# EAGLE design CR2032 emulator (EAGLE 9.6.2)
Assembly variants: basic
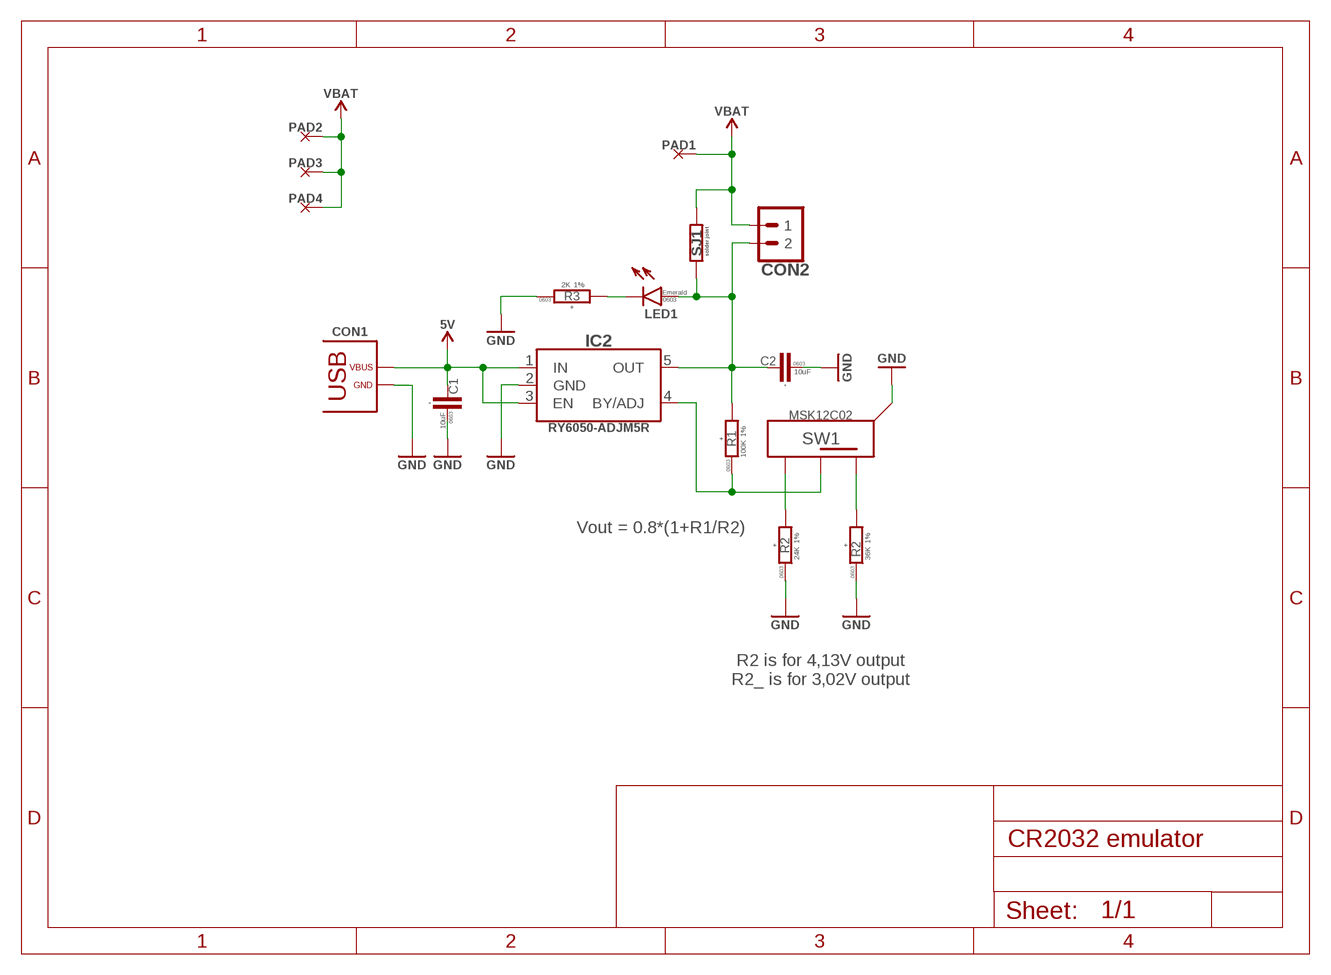
[diagram p0: schematic, sheet 1]

## Parts
C1  10uF  C-0603  [C0603]
C2  10uF  C-0603  [C0603]
CON1  USB_PWR-31-M-17  [TYPEC31M17]
CON2  PINHEAD_1X02-2  [1X02-PTH-2]  (not fitted in variant basic)
IC2  RY6050-ADJM5R  [SOT23-5]
LED1  LED-0603  [LED0603]
PAD1  PAD-3X1.5  [3X1.5]  (not fitted in variant basic)
PAD2  PAD-HOLE-0.6  [HOLE_0.6]  (not fitted in variant basic)
PAD3  PAD-HOLE-0.6  [HOLE_0.6]  (not fitted in variant basic)
PAD4  PAD-HOLE-0.6  [HOLE_0.6]  (not fitted in variant basic)
R1  100K  R-1%-0603  [R0603]
R2  24K  R-1%-0603  [R0603]
R2_  36K  R-1%-0603  [R0603]
R3  2K  R-1%-0603  [R0603]
SJ1  SOLDER_JOINT-SJ2  [SOLDER_JOINT_SMALL]  (not fitted in variant basic)
SW1  SPDT_SWITCH  [MSK-12C02]

## Nets
GND: C1.1 C2.1 CON1.A12(GND) CON1.B12(GND) IC2.2(GND) R2.1 R2_.1 R3.1 SW1.GND@1(PADS) SW1.GND@2(PADS) SW1.GND@3(PADS) SW1.GND@4(PADS)
N$1: LED1.C R3.2
N$2: C2.2 CON2.2 IC2.5(OUT) LED1.A R1.2 SJ1.1
N$3: R2_.2 SW1.L1(NC)
N$4: R2.2 SW1.L2(NO)
N$5: IC2.4(BY/ADJ) R1.1 SW1.COM
VBAT: CON2.1 PAD1.P$1 PAD2.P$1 PAD3.P$1 PAD4.P$1 SJ1.2
VDD_5V: C1.2 CON1.A9(VBUS) CON1.B9(VBUS) IC2.1(IN) IC2.3(EN) ; supply symbol labelled 5V

## Notes on the sheet
- Vout = 0.8*(1+R1/R2)
- R2 is for 4,13V output
  R2_ is for 3,02V output

## Library data of the parts
C1 C2 = rc:C; ALLOCATED: +; LCSC#: C96446; PACKAGE: 0603
CON1 = Connectors:USB_PWR; LCSC#: C283540; MANF: Korean Hroparts Elec; MANF#: TYPE-C-31-M-17
CON2 = pinhead:PINHEAD_1X02: pinheader 2P
IC2 = linear regulators:RY6050-ADJM5R; ALT_LCSC#: C224224; LCSC#: C2890981; MANF: RYCHIP Semiconductor Inc; MANF#: RY6050-ADJM5R
LED1 = rc:LED: Light emitting diode; COLOR: Emerald; LCSC#: C72043; PACKAGE: 0603
PAD1 = PADS:PAD; BOM: EXCLUDE
PAD2-PAD4 = PADS:PAD
R1 = rc:R; ALLOCATED: +; LCSC#: C25803; PACKAGE: 0603; TOLERANCE: 1%
R2 = rc:R; ALLOCATED: +; LCSC#: C23352; PACKAGE: 0603; TOLERANCE: 1%
R2_ = rc:R; ALLOCATED: +; LCSC#: C23147; PACKAGE: 0603; TOLERANCE: 1%
R3 = rc:R; ALLOCATED: +; LCSC#: C22975; PACKAGE: 0603; TOLERANCE: 1%
SJ1 = misc:SOLDER_JOINT
SW1 = mechanical:SPDT_SWITCH; LCSC#: C431540; MANF: SHOU HAN; MANF#: MSK12C02

## Board
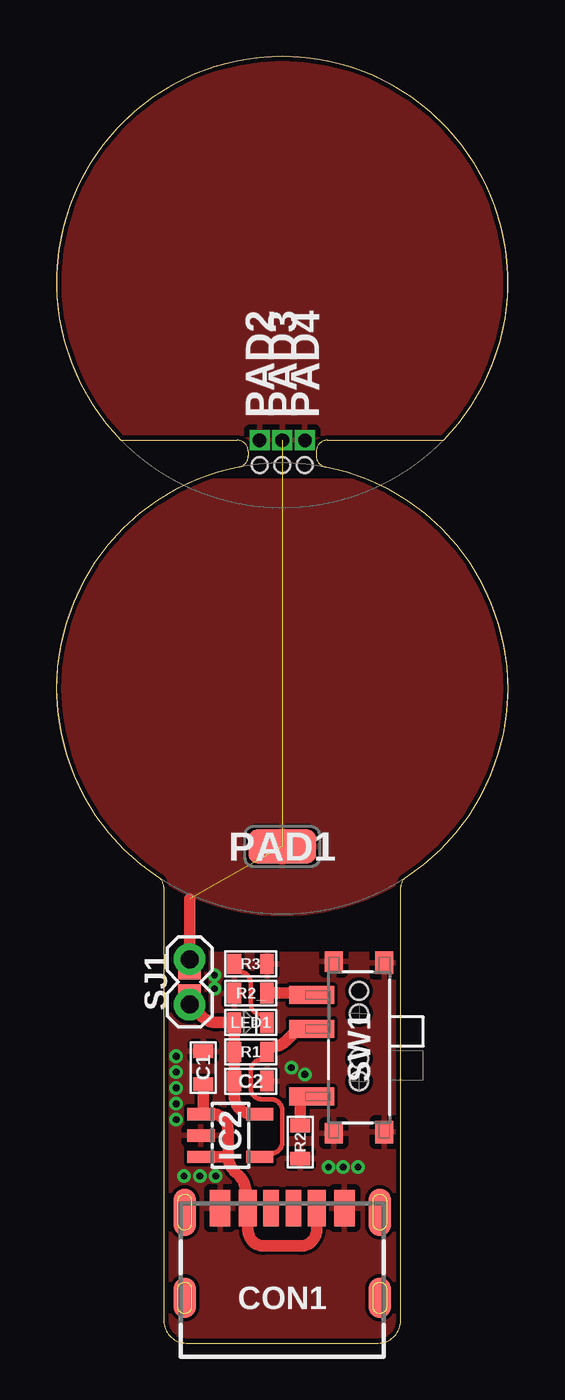
[diagram p1: board, top side]
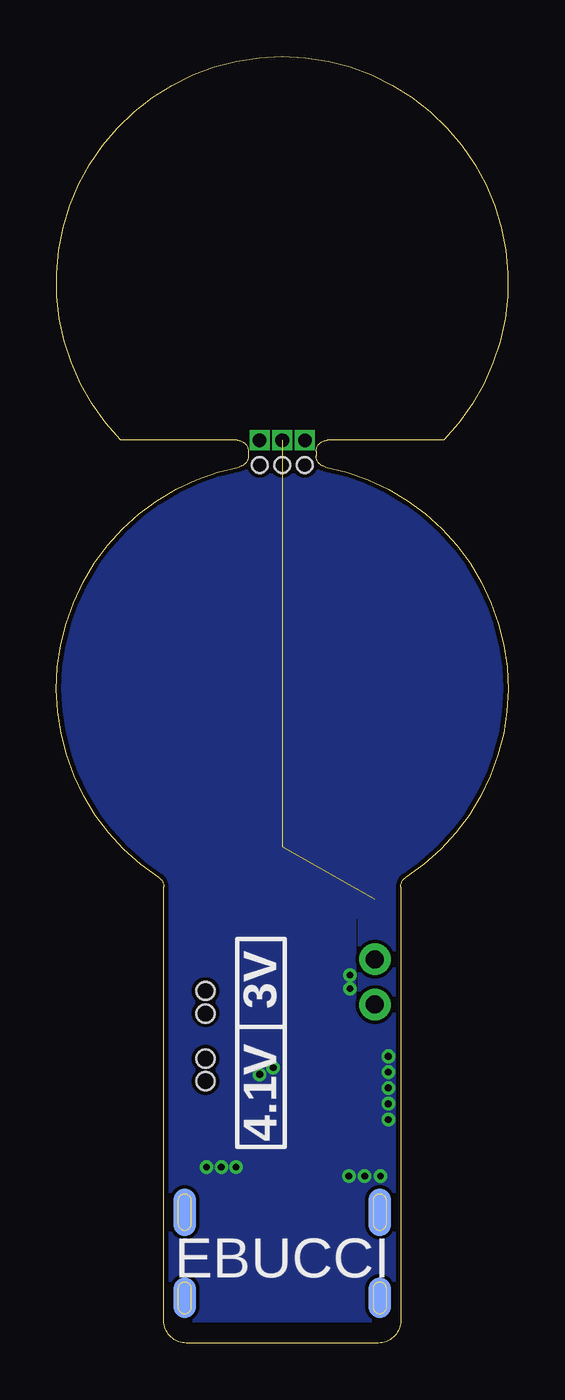
[diagram p2: board, bottom side, seen from below]

Size 20 x 57 mm. Coordinates in mm from the lower left corner, seen from the top.
Outline: 15.48,20.63 arc136 11.9,38.82 arc-79 11.5,39.31 11.5,39.5 arc-90 12,40 17.14,40 arc269 2.86,40 8,40 arc-90 8.5,39.5 8.5,39.31 arc-79 8.09,38.82 arc136 4.52,20.63 arc-57 4.75,20.21 4.75,1 arc90 5.75,0 14.25,0 arc90 15.25,1 15.25,20.21 arc-57 15.48,20.63
Copper layers (1*16): Top 0.035mm / dielectric 1.5mm / Bottom 0.035mm
Design rules "JLCPCB 2 layer": minimum track width 6mil, minimum drill 0.3mm, track to track 0.15mm, track to pad 0.15mm, pad to pad 0.15mm, via to via 0.15mm, smd to smd 0.1mm, copper to edge 0.2mm, drill to drill 6mil, minimum pad ring 0.15mm, minimum via ring 0.15mm, stop-mask expansion 0.05mm, vias tented up to drill 0.3mm, thermal gap 10mil
Holes 0.8 mm at 13.4,12.6 13.4,15.6
Holes 0.7 mm at 9,38.9 10,38.9 11,38.9
tRestrict: 3 lines
bRestrict: 2 lines

### Footprints (pad centres in the part's own frame; a part is rotated, then mirrored left to right if it is on the bottom)
C0603 = smd 0.6 x 0.9: 1 -0.725,0; 2 0.725,0
TYPEC31M17 = smd 0.7 x 1.6: A5 -0.5,3.98; B5 0.5,3.98 | smd 0.8 x 1.6: A9 1.52,3.98; B9 -1.52,3.98 | smd 0.9 x 1.6: A12 2.75,3.98; B12 -2.75,3.98 | smd 1 x 2.1 bottom: P$1 -4.32,3.8; P$2 4.32,3.8 | smd 1 x 1.8 bottom: P$3 4.32,0; P$4 -4.32,0 | smd 1 x 2.1: P$13 4.32,3.8; P$14 -4.32,3.8 | smd 1 x 1.8: P$15 -4.32,0; P$16 4.32,0
1X02-PTH-2 = drill 0.8 pad 1.4: 1 -1,0; 2 1,0
SOT23-5 = smd 1.2 x 0.55: 1 1.3,-0.95; 2 1.3,0; 3 1.3,0.95; 4 -1.3,0.95; 5 -1.3,-0.95
LED0603 = smd 0.6 x 0.9: A 0.725,0; C -0.725,0
3X1.5 = smd 3 x 1.5: P$1 0,0
HOLE_0.6 = drill 0.6 square: P$1 0,0
R0603 = smd 0.6 x 0.9: 1 -0.725,0; 2 0.725,0
SOLDER_JOINT_SMALL = smd 1 x 1: 1 -0.6,0; 2 0.6,0
MSK-12C02 = smd 0.8 x 2: COM 0.823,2.1; L1 2.323,2.1; L2 -2.177,2.1 | smd 1 x 0.8: GND@1 -3.75,-1.125; GND@4 3.75,-1.125 | smd 0.9 x 0.8: GND@2 -3.8,1.125; GND@3 3.8,1.125 | hole 0.8: -1.5,0; 1.5,0

### Placement (x,y rotation side)
C1  6.5,12.2 270 top
C2  8.6,11.6 180 top
CON1  10,2 0 top
CON2  5.9,16 270 top
IC2  7.7,9.2 180 top
LED1  8.6,14.2 180 top
PAD1  10,22 0 top
PAD2  9,40 90 top
PAD3  10,40 90 top
PAD4  11,40 90 top
R1  8.6,12.9 180 top
R2  10.8,8.9 90 top
R2_  8.6,15.5 0 top
R3  8.6,16.8 180 top
SJ1  5.9,16 90 top
SW1  13.4,13.1 90 top

### Tracks (layer width: path | path; a pad name or v marks a point on that pad's centre or on a via)
GND  (via drill 0.3 pad 0.6)
  other vias: 5.3,11.3 5.3,10.6 5.3,9.9 10.4,12.2 11,11.9 12.05,7.8 12.7,7.8 13.35,7.8 5.65,7.4 5.3,12 5.3,12.7 7,16.3 7,15.7 6.35,7.4 7.05,7.4
  pour Top: 4.75,0 4.75,17.5 15.25,17.5 15.25,0
  pour Bottom: 0,1 0,29 arc-90 10,39 arc-90 20,29 20,1
N$1
  Top 0.2: LED1.C 9.32,14.55 9.1,14.55 arc-90 8.6,15.05 8.6,15.95 arc90 8.1,16.45 7.87,16.45 R3.2
N$2
  Top 0.2: SJ1.1 CON2.2
  Top 0.5: IC2.5 8.67,10.15 arc-90 7.87,10.95 C2.2 R1.2 LED1.A 7.11,14.2 arc-45 6.41,14.49 CON2.2
N$3
  Top 0.5: SW1.L1 11.2,15.52 9.32,15.52 R2_.2
N$4
  Top 0.5: SW1.L2 10.8,10.92 R2.2
N$5
  Top 0.2: R1.1 9.32,12.55 9.1,12.55 arc90 8.6,12.05 8.6,11.3 arc90 9.1,10.8 9.5,10.8 arc-90 10,10.3 10,8.9 arc-90 9.5,8.4 9.15,8.4 IC2.4
  Top 0.5: SW1.COM 10.7,13.92 10.17,13.39 arc-45 9.46,13.1 9.32,13.1 R1.1
VBAT  (2 unrouted)
  Top 0.5: CON2.1 SJ1.2 5.9,19.69
  pour Top: 10,57 0,57 0,40 20,40 20,57
  pour Top: 0,29 arc90 10,19 arc90 20,29 arc90 10,39 arc90
VDD_5V
  Top 0.5: CON1.A9 11.52,5 arc-90 10.82,4.3 9.18,4.3 arc-90 8.48,5 CON1.B9 8.38,6.08 8.38,6.71 arc45 8.09,7.41 7.88,7.62 arc-45 7.6,8.3 | IC2.1 6.61,10.15 | 6.61,10.15 6.9,10.15 arc-90 7.6,9.45 7.6,8.3 | IC2.3 7.55,8.25 7.6,8.3 | 6.61,10.15 6.5,10.26 C1.2

### Text on the board
bPlace: 3V | 4.1V | EBUCCI
tRestrict: + | +